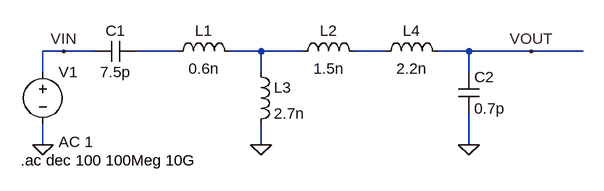
[diagram p0: schematic BLE_Input.asc]
BLE_Input.asc, the LTspice schematic file:
Version 4
SHEET 1 1072 680
WIRE 96 128 64 128
WIRE 144 128 96 128
WIRE 272 128 208 128
WIRE 400 128 352 128
WIRE 464 128 400 128
WIRE 592 128 544 128
WIRE 720 128 672 128
WIRE 816 128 720 128
WIRE 896 128 816 128
WIRE 64 160 64 128
WIRE 400 160 400 128
WIRE 720 160 720 128
WIRE 64 272 64 240
WIRE 400 272 400 240
WIRE 720 272 720 224
FLAG 64 272 0
FLAG 400 272 0
FLAG 720 272 0
FLAG 816 128 VOUT
FLAG 96 128 VIN
SYMBOL cap 208 112 R90
WINDOW 0 0 32 VBottom 2
WINDOW 3 32 32 VTop 2
SYMATTR InstName C1
SYMATTR Value 7.5p
SYMBOL ind 256 144 R270
WINDOW 0 32 56 VTop 2
WINDOW 3 5 56 VBottom 2
SYMATTR InstName L1
SYMATTR Value 0.6n
SYMBOL ind 448 144 R270
WINDOW 0 32 56 VTop 2
WINDOW 3 5 56 VBottom 2
SYMATTR InstName L2
SYMATTR Value 1.5n
SYMBOL ind 384 144 R0
SYMATTR InstName L3
SYMATTR Value 2.7n
SYMBOL ind 576 144 R270
WINDOW 0 32 56 VTop 2
WINDOW 3 5 56 VBottom 2
SYMATTR InstName L4
SYMATTR Value 2.2n
SYMBOL cap 704 160 R0
SYMATTR InstName C2
SYMATTR Value 0.7p
SYMBOL voltage 64 144 R0
WINDOW 123 24 124 Left 2
WINDOW 39 0 0 Left 0
SYMATTR InstName V1
SYMATTR Value ""
SYMATTR Value2 AC 1
TEXT 30 296 Left 2 !.ac dec 100 100Meg 10G

The netlist it stands for:
* BLE_Input.asc
C1 N001 VIN 7.5p
L1 N001 N002 0.6n
L2 N002 N003 1.5n
L3 N002 0 2.7n
L4 N003 VOUT 2.2n
C2 VOUT 0 0.7p
V1 VIN 0 AC 1
.ac dec 100 100Meg 10G
.backanno
.end